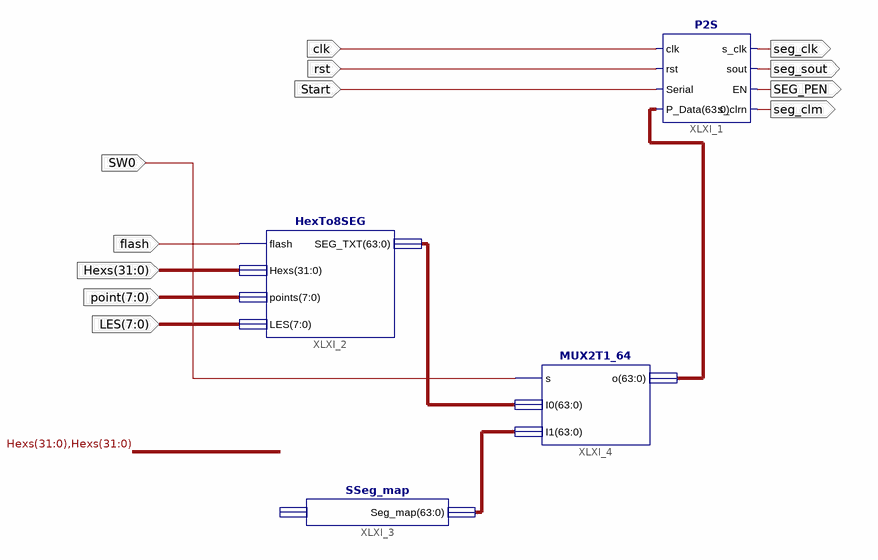
[diagram p0: schematic sheet 1]
// Xilinx ISE schematic Display.sch (kintex7) as structural Verilog: 4 symbols, 12 ports
module Display (
  input  flash,
  input  [31:0] Hexs,
  input  [7:0] point,
  input  [7:0] LES,
  input  SW0,
  input  clk,
  input  rst,
  input  Start,
  output seg_clk,
  output seg_sout,
  output SEG_PEN,
  output seg_clm
);

  wire [63:0] XLXN_5, XLXN_8, XLXN_13;

  P2S XLXI_1 (
    .s_clrn(seg_clm), .sout(seg_sout), .rst(rst), .EN(SEG_PEN), .Serial(Start), .clk(clk), .s_clk(seg_clk),
    .P_Data(XLXN_13));
  HexTo8SEG XLXI_2 (.flash(flash), .Hexs(Hexs), .points(point), .LES(LES), .SEG_TXT(XLXN_5));
  SSeg_map XLXI_3 (.Seg_map(XLXN_8));  // open: Disp_num
  MUX2T1_64 XLXI_4 (.s(SW0), .I0(XLXN_5), .I1(XLXN_8), .o(XLXN_13));
endmodule
